# Altium schematic sheet I2CADC.SchDoc
size A; PageSetup: Record=PageOptions|CenterHorizontal=True|CenterVertical=True|PrintScale=1.09|XCorrection=1.00|YCorrection=1.00|PrintKind=1|BorderSize=5000000|LeftOffset=0|BottomOffset=0|Orientation=2|PaperLength=1000|PaperWidth=1000|Scale=100|PaperSource=7|PrintQuality=-4|MediaType=1|DitherType=10|PaperKind=A4|PrintScaleMode=1
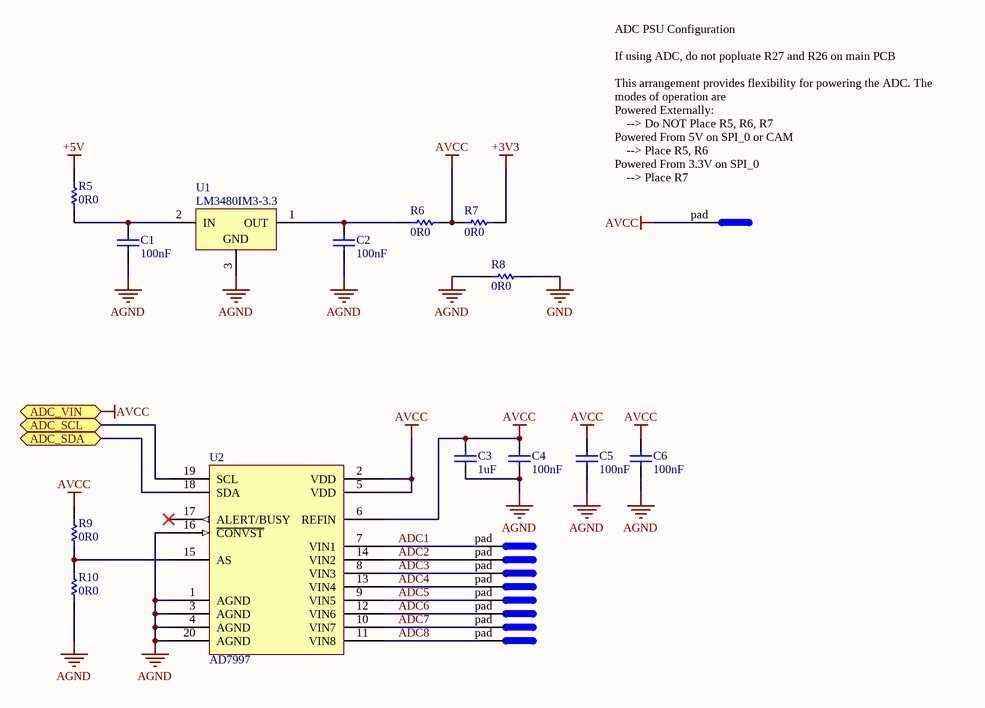
[diagram p0: I2CADC.SchDoc]

## Parts
A1  (no value)  [PAD_ROUND]
A2  (no value)  [PAD_ROUND]
A3  (no value)  [PAD_ROUND]
A4  (no value)  [PAD_ROUND]
A5  (no value)  [PAD_ROUND]
A6  (no value)  [PAD_ROUND]
A7  (no value)  [PAD_ROUND]
A8  (no value)  [PAD_ROUND]
A+  (no value)  [PAD_ROUND]
C1  100nF  [0603]
C2  100nF  [0603]
C3  1uF  [0603]
C4  100nF  [0603]
C5  100nF  [0603]
C6  100nF  [0603]
R5  0R0  [0805]  (no BOM)
R6  0R0  [0805]  (no BOM)
R7  0R0  [0805]  (no BOM)
R8  0R0  [0805]  (no BOM)
R9  0R0  [0805]  (no BOM)
R10  0R0  [0805]  (no BOM)
U1  LM3480IM3-3.3  [MF03A_N]
U2  AD7997  [TSOP65P640-20AM]

## Ports
ADC_SCL (bidir), ADC_SDA (bidir), ADC_VIN

## Nets
+3V3: R7.1
+5V: R5.2
AGND: C1.1 C2.1 C3.1 C4.1 C5.1 C6.1 R8.1 R10.2 U1.3(GND) U2.1(AGND) U2.3(AGND) U2.4(AGND) U2.16(~{CONVST}) U2.20(AGND)
AVCC: A+.pad C3.2 C4.2 C5.2 C6.2 R6.1 R7.2 R9.2 U2.2(VDD) U2.5(VDD) U2.6(REFIN) ; port ADC_VIN
GND: R8.2
ADC1: A1.pad U2.7(VIN1)
ADC2: A2.pad U2.14(VIN2)
ADC3: A3.pad U2.8(VIN3)
ADC4: A4.pad U2.13(VIN4)
ADC5: A5.pad U2.9(VIN5)
ADC6: A6.pad U2.12(VIN6)
ADC7: A7.pad U2.10(VIN7)
ADC8: A8.pad U2.11(VIN8)
ADC_SCL: U2.19(SCL) ; port ADC_SCL
ADC_SDA: U2.18(SDA) ; port ADC_SDA
NetC1_2: C1.2 R5.1 U1.2(IN)
NetC2_2: C2.2 R6.2 U1.1(OUT)
NetR9_1: R9.1 R10.1 U2.15(AS)

Not connected (* = marked no-connect by the designer): U2 17(ALERT/BUSY)*

## Notes on the sheet
- (near A+) ADC PSU Configuration
  If using ADC, do not popluate R27 and R26 on main PCB
  This arrangement provides flexibility for powering the ADC. The modes of operation are
  Powered Externally:
  --> Do NOT Place R5, R6, R7
  Powered From 5V on SPI_0 or CAM
  --> Place R5, R6
  Powered From 3.3V on SPI_0
  --> Place R7

## Library data of the parts
A1-A8 A+ = JP_pad: Pad; pin to pad: pad>1
C1 C2 C4-C6 = CP_100nF 0603: CAP CER .10UF 50V X5R 0603; Manufacturer: Taiyo Yuden; Manufacturer PN: UMK107B7104KA-T; Prototype: Digikey 587-1243-1-ND; LatestRevisionDate: 29 May 08; Value: 100nF
C3 = CP_1uF 0603: CAP CER 1.0UF 50V X5S 0603; Manufacturer: Taiyo Yuden; Manufacturer PN: UMK107C5105KA-T; Prototype: Digikey 587-1992-1-ND; Value: 1uF
R5-R8 = RS_0R0 0603: RES 0.0 OHM 1/10W 5% 1206 SMD; Manufacturer: Rohm; Manufacturer PN: MCR03EZPJ000; Prototype: DigiKey P0.0ECT-ND; LatestRevisionDate: 3 Jun 08; Value: 0R0
R9 R10 = RS_0R0 0603: RES 0.0 OHM 1/10W 5% 0603 SMD; Manufacturer: Rohm; Manufacturer PN: MCR03EZPJ000; Prototype: DigiKey RHM0.0GCT-ND; LatestRevisionDate: 3 Jun 08; Value: 0R0
U1 = LM3480IM3-3.3: 100 mA, SOT-23, Quasi Low-Dropout Linear Voltage Regulator; Manufacturer: National Semiconductor; CompType: LDO IC; PackageTopMarking: L0A*XTT; Published: 4-Dec-2008; DatasheetVersion: Mar-2005; PackageVersion: revB, Mar-2003; PackageReference: MF03A; Publisher: Altium Limited; PackageDescription: Molded SOT-23, .115 x .051 x .037in Body, 3 Lead, .075 in Pitch; PartNumber: LM3480IM3-3.3; RoHS: O; PinCount: 3; DigiKeyPartNumber: LM3480IM3-3.3CT-ND; ComponentLink1Description: LM3480 Datasheet; ComponentLink1URL: http://www.national.com/ds/LM/LM3480.pdf; ComponentLink2Description: LM3480 Web Page; ComponentLink2URL: http://www.national.com/pf/LM/LM3480.html; ComponentLink3Description: MF03A Package Page; ComponentLink3URL: http://www.national.com/packaging/folders/mf03a.html
U2 = IC_AD7997: 10-bit 8 channel ADC